# Altium project GR_Propulsion_Via.PrjPCB
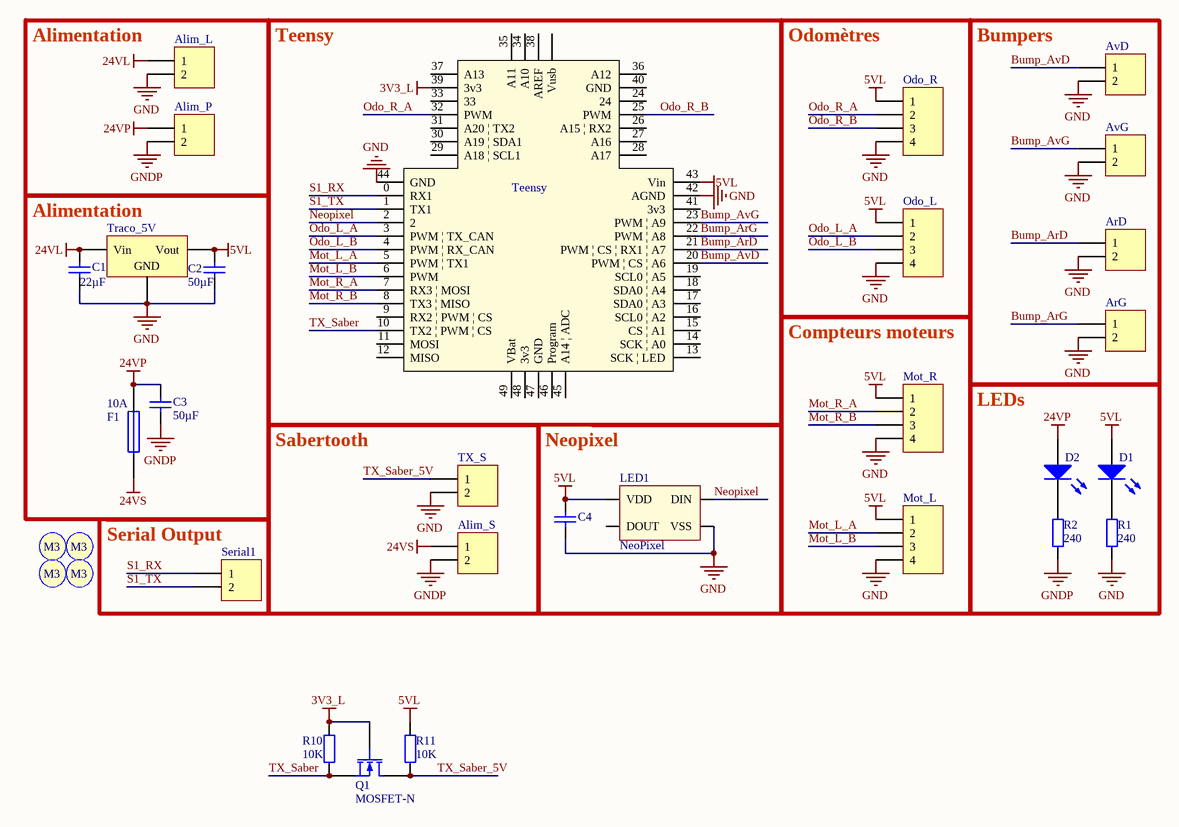
[diagram p0: GR_Propulsion.SchDoc]
1 sheet, 32 parts. Net scope: global (net labels, ports and power ports of the same name join across sheets).
Board file: GR_Propulsion.PcbDoc

## Sheet GR_Propulsion.SchDoc
size A4

### Parts
Alim_L  Minifit Jr 2x1H  [Molex_MiniFitJr_2x1H]  (value not drawn)
Alim_P  Minifit Jr 2x1H  [Molex_MiniFitJr_2x1H]  (value not drawn)
Alim_S  Minifit Jr 2x1H  [Molex_MiniFitJr_2x1H]  (value not drawn)
ArD  SPOX 2x1H  [Molex SPOX 2x1H]  (value not drawn)
ArG  SPOX 2x1H  [Molex SPOX 2x1H]  (value not drawn)
AvD  SPOX 2x1H  [Molex SPOX 2x1H]  (value not drawn)
AvG  SPOX 2x1H  [Molex SPOX 2x1H]  (value not drawn)
C1  value 22µF  [3.2X1.6X1.1]  (hidden comment: Cap22uF)
C2  value 50µF  [3.2X1.6X1.1]  (hidden comment: Cap50uF)
C3  value 50µF  [Condensateur]  (hidden comment: Cap50uF)
C4  Cap  [3.2X1.6X1.1]  (value not drawn)
D1  LED1  [3.2X1.6X1.1]  (value not drawn)
D2  LED2  [3.2X1.6X1.1]  (value not drawn)
F1  10A  [Fuse]
LED1  NeoPixel  [Neopixel]
Mot_L  SPOX 4x1H  [Molex SPOX 4x1H]  (value not drawn)
Mot_R  SPOX 4x1H  [Molex SPOX 4x1H]  (value not drawn)
Odo_L  SPOX 4x1H  [Molex SPOX 4x1H]  (value not drawn)
Odo_R  SPOX 4x1H  [Molex SPOX 4x1H]  (value not drawn)
Q1  MOSFET-N  [SOT23_N]
R1  value 240  [3.2X1.6X1.1]  (hidden comment: Res2)
R2  value 240  [3.2X1.6X1.1]  (hidden comment: Res2)
R10  value 10K  [3.2X1.6X1.1]  (hidden comment: Res2)
R11  value 10K  [3.2X1.6X1.1]  (hidden comment: Res2)
S1  Screw M3  [Screw M3]  (value not drawn)
S2  Screw M3  [Screw M3]  (value not drawn)
S3  Screw M3  [Screw M3]  (value not drawn)
S4  Screw M3  [Screw M3]  (value not drawn)
Serial1  SPOX 2x1H  [Molex SPOX 2x1H]  (value not drawn)
Teensy  Teensy 3.2  [teensy]  (value not drawn)
Traco_5V  Traco TRS2-2450  [TRS]  (value not drawn)
TX_S  SPOX 2x1H  [Molex SPOX 2x1H]  (value not drawn)

### Blocks framed on the sheet
Alimentation: Alim_L Alim_P
Teensy: Teensy
Odomètres: Odo_L Odo_R
Bumpers: ArD ArG AvD AvG
Alimentation: C1-C3 F1 Traco_5V
Compteurs moteurs: Mot_L Mot_R
LEDs: D1 D2 R1 R2
Sabertooth: Alim_S TX_S

### Nets
3V3_L: Q1.2(G) R10.1 Teensy.39(3v3)
5VL: C2.1 C4.2 D1.1(A) LED1.3(VDD) Mot_L.1 Mot_R.1 Odo_L.1 Odo_R.1 R11.1 Teensy.43(Vin) Traco_5V.3(Vout)
24VL: Alim_L.1 C1.2 Traco_5V.1(Vin)
24VP: Alim_P.1 C3.1 D2.1(A) F1.2
24VS: Alim_S.1 F1.1
GND: Alim_L.2 ArD.2 ArG.2 AvD.2 AvG.2 C1.1 C2.2 C4.1 LED1.1(VSS) Mot_L.4 Mot_R.4 Odo_L.4 Odo_R.4 R1.2 Teensy.42(AGND) Teensy.44(GND) Traco_5V.2(GND) TX_S.2
GNDP: Alim_P.2 Alim_S.2 C3.2 R2.2
Bump_ArD: ArD.1 Teensy.21(PWM_|_CS_|_RX1_|_A7)
Bump_ArG: ArG.1 Teensy.22(PWM_|_A8)
Bump_AvD: AvD.1 Teensy.20(PWM_|_CS_|_A6)
Bump_AvG: AvG.1 Teensy.23(PWM_|_A9)
Mot_L_A: Mot_L.2 Teensy.5(PWM_|_TX1)
Mot_L_B: Mot_L.3 Teensy.6(PWM)
Mot_R_A: Mot_R.2 Teensy.7(RX3_|_MOSI)
Mot_R_B: Mot_R.3 Teensy.8(TX3_|_MISO)
Neopixel: LED1.2(DIN) Teensy.2
Odo_L_A: Odo_L.2 Teensy.3(PWM_|_TX_CAN)
Odo_L_B: Odo_L.3 Teensy.4(PWM_|_RX_CAN)
Odo_R_A: Odo_R.2 Teensy.32(PWM)
Odo_R_B: Odo_R.3 Teensy.25(PWM)
S1_RX: Serial1.1 Teensy.0(RX1)
S1_TX: Serial1.2 Teensy.1(TX1)
TX_Saber: Q1.3(S) R10.2 Teensy.10(TX2_|_PWM_|_CS)
TX_Saber_5V: Q1.1(D) R11.2 TX_S.1
NetD1_2: D1.2(K) R1.1
NetD2_2: D2.2(K) R2.1

Not connected (* = marked no-connect by the designer): LED1 4(DOUT); Teensy 9(RX2_|_PWM_|_CS) 11(MOSI) 12(MISO) 13(SCK_|_LED) 14(SCK_|_A0) 15(CS_|_A1) 16(SCL0_|_A2) 17(SDA0_|_A3) 18(SDA0_|_A4) 19(SCL0_|_A5) 24 26(A15_|_RX2) 27(A16) 28(A17) 29(A18_|_SCL1) 30(A19_|_SDA1) 31(A20_|_TX2) 33 34(A10) 35(A11) 36(A12) 37(A13) 38(AREF) 40(GND) 41(3v3) 45(A14_|_ADC) 46(Program) 47(GND) 48(3v3) 49(VBat) 50(Vusb)

### Notes on the sheet
- Neopixel
- Serial Output
- (in symbol Screw M3) M3

### Library data of the parts
Alim_L Alim_P Alim_S = Header 2: Molex Minifit Jr 2x1H; LatestRevisionDate: 17-Jul-2002; LatestRevisionNote: Re-released for DXP Platform.; Publisher: Altium Limited
ArD ArG AvD AvG Serial1 TX_S = Header 2: Molex SPOX Jr 2x1H; LatestRevisionDate: 17-Jul-2002; LatestRevisionNote: Re-released for DXP Platform.; Publisher: Altium Limited
C1-C3 = Cap: Capacitor; Max Voltage: 50V; Published: 8-Jun-2000; LatestRevisionDate: 17-Jul-2002; LatestRevisionNote: Re-released for DXP Platform.; PackageReference: RAD-0.3; Publisher: Altium Limited; PackageDescription: Radial Cap, Thru-Hole; 2 Leads; 0.3 in Pin Spacing
C4 = Cap: Capacitor; Value: 1µF; Max Voltage: 50V; Published: 8-Jun-2000; LatestRevisionDate: 17-Jul-2002; LatestRevisionNote: Re-released for DXP Platform.; PackageReference: RAD-0.3; Publisher: Altium Limited; PackageDescription: Radial Cap, Thru-Hole; 2 Leads; 0.3 in Pin Spacing
D1 D2 = LED2: Typical RED, GREEN, YELLOW, AMBER GaAs LED; Published: 8-Jun-2000; LatestRevisionDate: 17-Jul-2002; LatestRevisionNote: Re-released for DXP Platform.; PackageVersion: Feb-2002; PackageReference: 3.2X1.6X1.1; Publisher: Altium Limited; PackageDescription: SM LED; 2 Flat Leads
F1 = Fuse 1: Fuse; Published: 8-Jun-2000; LatestRevisionDate: 17-Jul-2002; LatestRevisionNote: Re-released for DXP Platform.; PackageReference: PIN-W2/E2.8; Publisher: Altium Limited; PackageDescription: Thru-Hole; 2 Leads
Mot_L Mot_R Odo_L Odo_R = Header 4H: Molex SPOX 4x1H; LatestRevisionDate: 17-Jul-2002; LatestRevisionNote: Re-released for DXP Platform.; Publisher: Altium Limited
Q1 = MOSFET-N: N-Channel MOSFET; Published: 8-Jun-2000; LatestRevisionDate: 17-Jul-2002; LatestRevisionNote: Re-released for DXP Platform.; PackageVersion: 1995/1996; PackageReference: E3; Publisher: Altium Limited; PackageDescription: TO, Flat Index; 3 In-Line, Axial Leads; Body Dia. 4.6mm; Lead Dia. 0.5 mm (max)
R1 R2 R10 R11 = Res2: Resistor; Published: 8-Jun-2000; LatestRevisionDate: 17-Jul-2002; LatestRevisionNote: Re-released for DXP Platform.; PackageReference: AXIAL-0.4; Publisher: Altium Limited; PackageDescription: Axial Device, Thru-Hole; 2 Leads; 0.4 in Pin Spacing
Teensy = teensy3.2
Traco_5V = Volt Reg: Voltage Regulator; Published: 24-Mar-1999; LatestRevisionDate: 29-May-2009; LatestRevisionNote: IPC-7351 Footprint Added.; PackageReference: D2PAK; Publisher: Altium Limited; PackageDescription: 3-Pin Transistor Outline Package 2.54 mm Pitch, 15.1 mm Lead Span